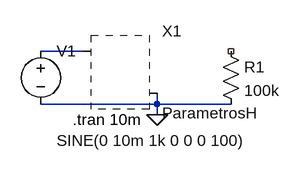
[diagram p0: schematic Draft2.asc]
Draft2.asc, the LTspice schematic file:
Version 4
SHEET 1 880 680
WIRE 80 112 16 112
WIRE 192 192 192 176
WIRE 192 192 16 192
WIRE 304 192 192 192
WIRE 192 208 192 192
FLAG 192 208 0
SYMBOL ParametrosH 192 128 R0
SYMATTR InstName X1
SYMBOL voltage 16 96 R0
WINDOW 3 24 152 Left 2
WINDOW 123 24 124 Left 2
WINDOW 39 0 0 Left 0
SYMATTR InstName V1
SYMATTR Value SINE(0 10m 1k 0 0 0 100)
SYMBOL res 288 96 R0
SYMATTR InstName R1
SYMATTR Value 100k
TEXT 64 216 Left 2 !.tran 10m

The netlist it stands for:
* Draft2.asc
* X1: ParametrosH (symbol ParametrosH not available, pin order unknown); nets seen at it: 0, N001
V1 N001 0 SINE(0 10m 1k 0 0 0 100)
R1 NC_01 0 100k
.tran 10m
.backanno
.end